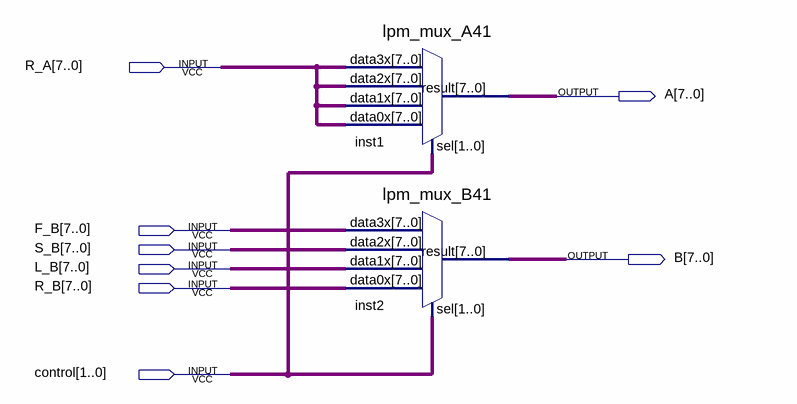
[diagram p0: schematic sheet]
// Quartus schematic OC.bdf as structural Verilog: 2 symbols, 8 pins
module OC (
  input  [7:0] R_A,
  input  [7:0] F_B,
  input  [7:0] S_B,
  input  [7:0] L_B,
  input  [7:0] R_B,
  input  [1:0] control,
  output [7:0] A,
  output [7:0] B
);

  lpm_mux_A41 inst1 (.data3x(R_A), .data2x(R_A), .data1x(R_A), .data0x(R_A), .sel(control), .result(A));
  lpm_mux_B41 inst2 (.data3x(F_B), .data2x(S_B), .data1x(L_B), .data0x(R_B), .sel(control), .result(B));
endmodule
